# Altium project AVR32_uart_communication_board.PrjPcb
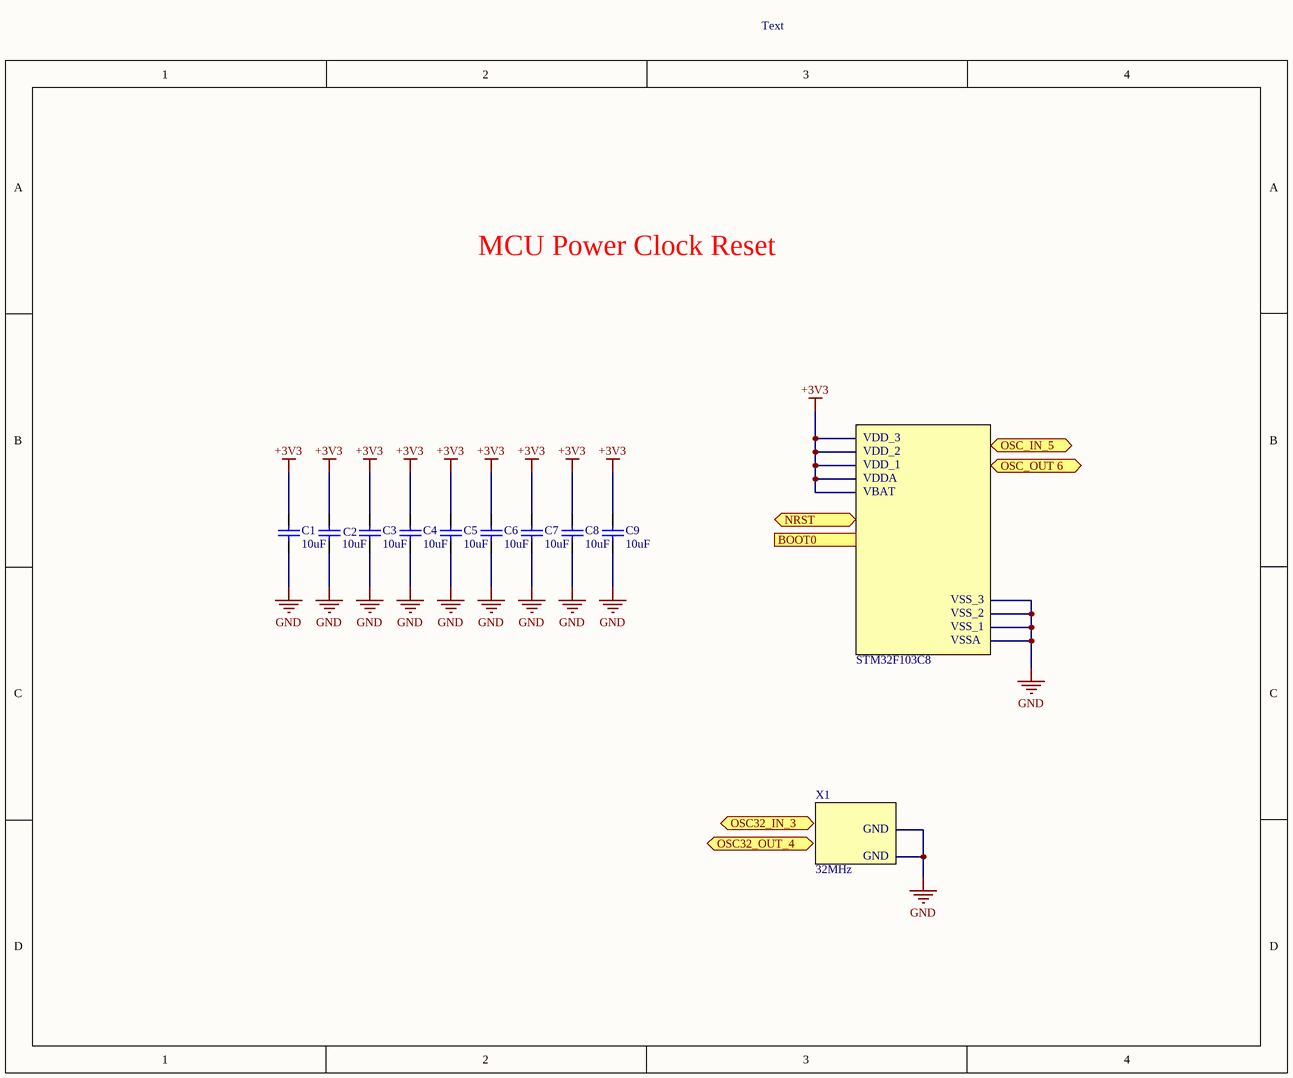
[diagram p0: Component_Part1.SchDoc]
2 sheets, 9 parts. Net scope: flat (ports and power ports of the same name join across sheets).
Sheets:
  Component_Part1.SchDoc
  Component_Part2.SchDoc

## Sheet Component_Part1.SchDoc
size A; SheetNumber: 1; SheetTotal: 2

### Parts
C1  value 10uF  (hidden comment: Capacitor)
C2  value 10uF  (hidden comment: Capacitor)
C3  value 10uF  (hidden comment: Capacitor)
C4  value 10uF  (hidden comment: Capacitor)
C5  value 10uF  (hidden comment: Capacitor)
C6  value 10uF  (hidden comment: Capacitor)
C7  value 10uF  (hidden comment: Capacitor)
C8  value 10uF  (hidden comment: Capacitor)
C9  value 10uF  (hidden comment: Capacitor)

### Ports
BOOT0 (in), NRST (bidir), OSC32_IN_3 (bidir), OSC32_OUT_4 (bidir), OSC_IN_5 (bidir), OSC_OUT 6 (bidir)

### Nets
+3V3: C1.1 C2.1 C3.1 C4.1 C5.1 C6.1 C7.1 C8.1 C9.1
GND: C1.2 C2.2 C3.2 C4.2 C5.2 C6.2 C7.2 C8.2 C9.2

### Notes on the sheet
- Text
- MCU Power Clock Reset
- VDD_3
- VDD_2
- VDD_1
- VDDA
- VBAT
- VSS_3
- VSS_2
- STM32F103C8
- VSS_1
- VSSA
- X1
- GND
- 32MHz

### Library data of the parts
C1-C9 = Capacitor: SimulationGenericComponent: True

## Sheet Component_Part2.SchDoc
size A; SheetNumber: 2; SheetTotal: 2
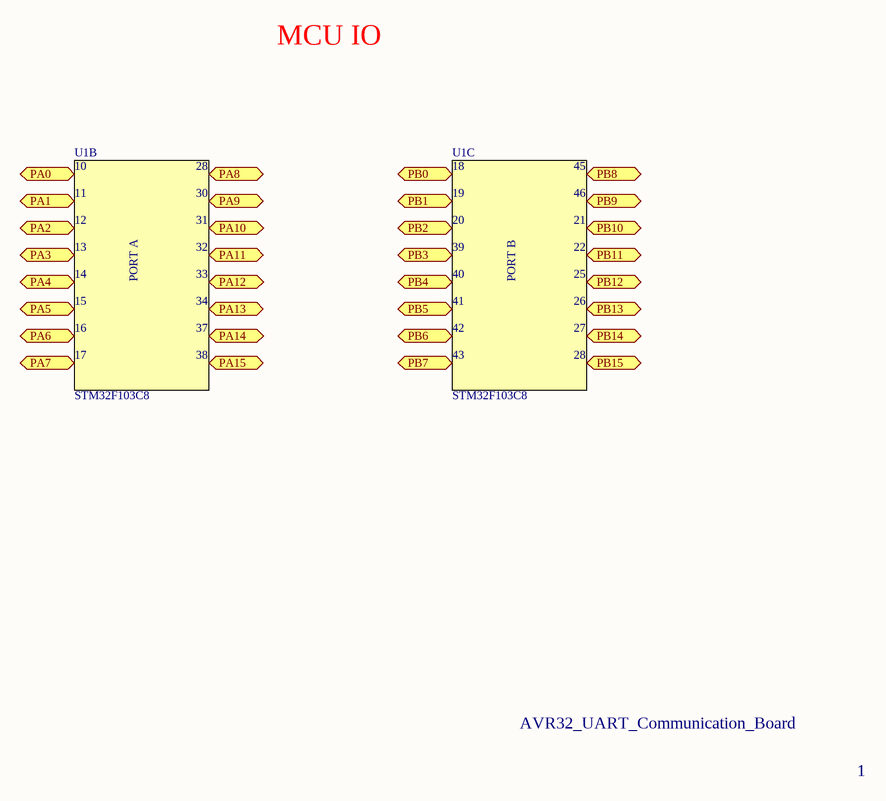
[diagram p1: Component_Part2.SchDoc]

### Ports
PA0 (bidir), PA1 (bidir), PA2 (bidir), PA3 (bidir), PA4 (bidir), PA5 (bidir), PA6 (bidir), PA7 (bidir), PA8 (bidir), PA9 (bidir), PA10 (bidir), PA11 (bidir), PA12 (bidir), PA13 (bidir), PA14 (bidir), PA15 (bidir), PB0 (bidir), PB1 (bidir), PB2 (bidir), PB3 (bidir), PB4 (bidir), PB5 (bidir), PB6 (bidir), PB7 (bidir), PB8 (bidir), PB9 (bidir), PB10 (bidir), PB11 (bidir), PB12 (bidir), PB13 (bidir), PB14 (bidir), PB15 (bidir)

### Notes on the sheet
- MCU IO
- 10
- U1B
- 28
- 18
- U1C
- 45
- 11
- 12
- 13
- 30
- 31
- 32
- 19
- 20
- 39
- 46
- 21
- 22
- 14
- 15
- PORT A
- 33
- 34
- 40
- 41
- PORT B
- 25
- 26
- 16
- 17
- 37
- 38
- 42
- 43
- 27
- STM32F103C8
- AVR32_UART_Communication_Board
- 1